# Altium schematic sheet R1250GS HandHeater and rear 5-12V.SchDoc: Rear power supply +5/12V; Clutch/Brake Heater
size A4; Revision: -; SheetNumber: 1; SheetTotal: 1; Version: 1.0; Variant: 4x Line of +5V and +12V; Modification: Clutch and Brake heater (ON by Drv Heater); Project: R1250GS HandHeater and rear 5-12V
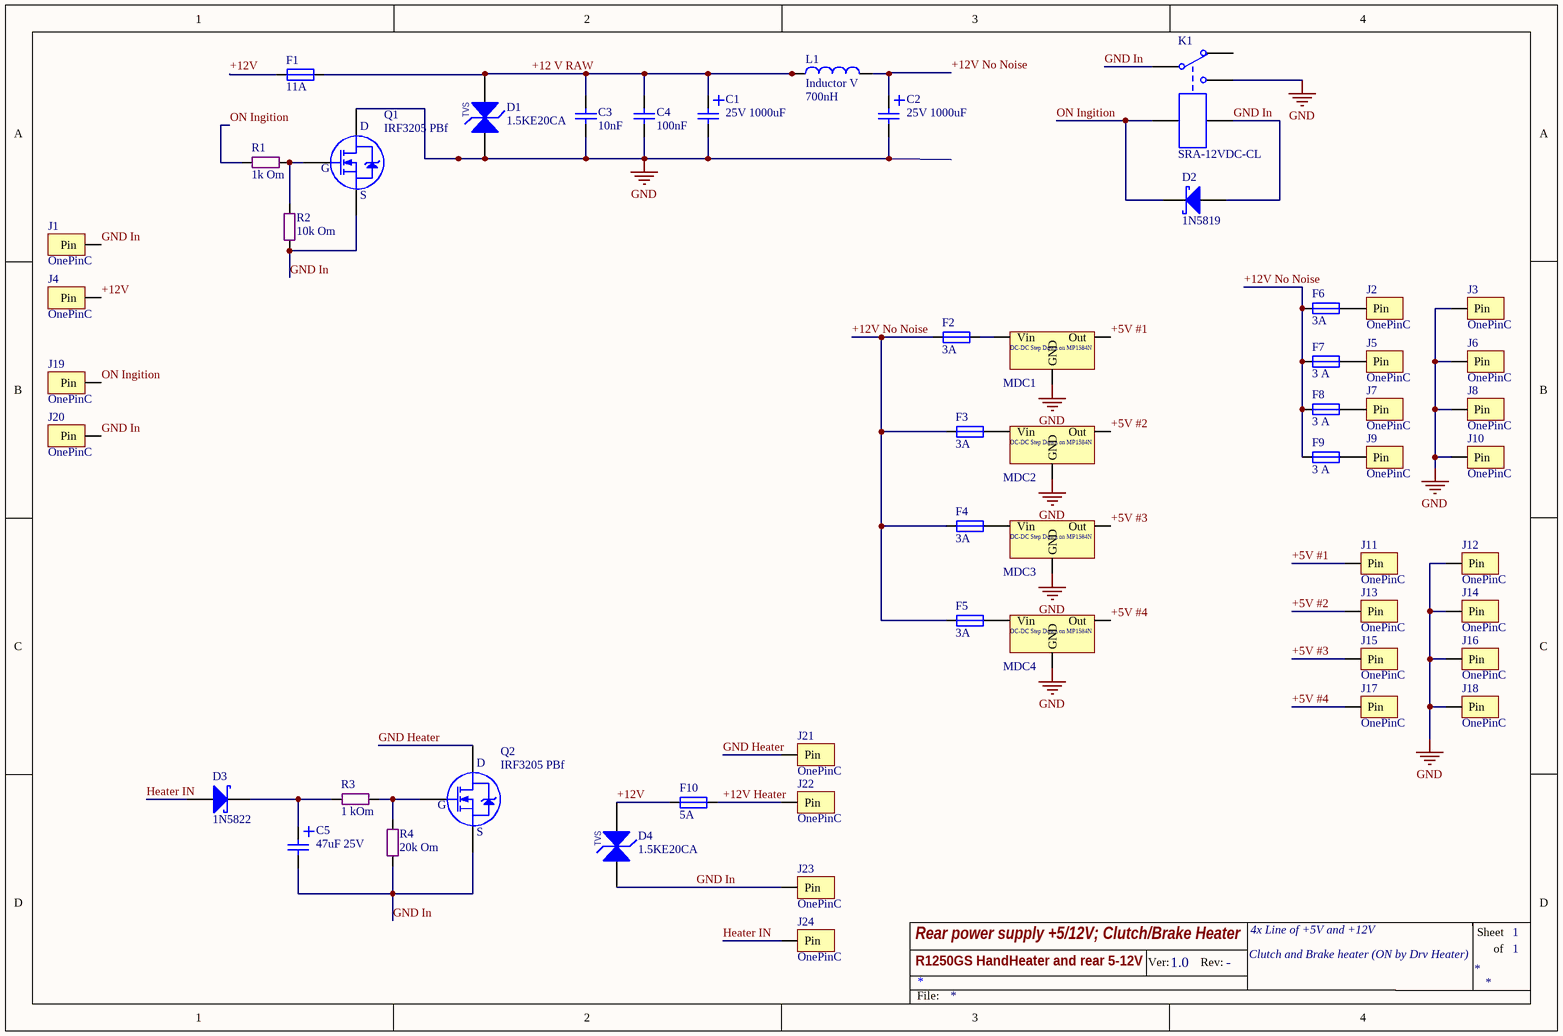
[diagram p0: R1250GS HandHeater and rear 5-12V.SchDoc]

## Parts
C1  25V 1000uF  [Cap E p5.08mm D10.2mm (3p)]
C2  25V 1000uF  [Cap E p5.08mm D10.2mm (3p)]
C3  10nF  [SMD 1206 (3216)]
C4  100nF  [SMD 1206 (3216)]
C5  47uF 25V  [Cap E p2mm D6.5xH11]
D1  1.5KE20CA  [TVS diode DO-201 V]
D2  1N5819  [Diode DO-35]
D3  1N5822  [Diode DO-41 - Vertical]
D4  1.5KE20CA  [TVS diode DO-201 V]
F1  11A  [Fuse RGE1100]
F2  3A  [Fuse SM250]
F3  3A  [Fuse SM250]
F4  3A  [Fuse SM250]
F5  3A  [Fuse SM250]
F6  3A  [Fuse MF-R300 (3A)]
F7  3 A  [Fuse MF-R300 (3A)]
F8  3 A  [Fuse MF-R300 (3A)]
F9  3 A  [Fuse MF-R300 (3A)]
F10  5A  [Fuse MF-R500 (5A)]
J1  OnePinC  [OnePin 1.8x4 - Square]
J2  OnePinC  [OnePin 1.2x3 - Rounded]
J3  OnePinC  [OnePin 1.2x3 - Square]
J4  OnePinC  [OnePin 1.8x4 - Rounded]
J5  OnePinC  [OnePin 1.2x3 - Rounded]
J6  OnePinC  [OnePin 1.2x3 - Square]
J7  OnePinC  [OnePin 1.2x3 - Rounded]
J8  OnePinC  [OnePin 1.2x3 - Square]
J9  OnePinC  [OnePin 1.2x3 - Rounded]
J10  OnePinC  [OnePin 1.2x3 - Square]
J11  OnePinC  [OnePin 1.2x3 - Rounded]
J12  OnePinC  [OnePin 1.2x3 - Square]
J13  OnePinC  [OnePin 1.2x3 - Rounded]
J14  OnePinC  [OnePin 1.2x3 - Square]
J15  OnePinC  [OnePin 1.2x3 - Rounded]
J16  OnePinC  [OnePin 1.2x3 - Square]
J17  OnePinC  [OnePin 1.2x3 - Rounded]
J18  OnePinC  [OnePin 1.2x3 - Square]
J19  OnePinC  [OnePin 1.2x3]
J20  OnePinC  [OnePin 1.2x3 - Square]
J21  OnePinC  [OnePin 1.8x4 - Square]
J22  OnePinC  [OnePin 1.8x4 - Rounded]
J23  OnePinC  [OnePin 1.2x3 - Square]
J24  OnePinC  [OnePin 1.2x3]
K1  SRA-12VDC-CL  [SRA-12VDC-CL]
L1  Inductor V  value 700nH  [Toroid V D20 W7]
MDC1  DC-DC  [DC-DC_MP1584N (SMALL)]  (value not drawn)
MDC2  DC-DC  [DC-DC_MP1584N (SMALL)]  (value not drawn)
MDC3  DC-DC  [DC-DC_MP1584N (SMALL)]  (value not drawn)
MDC4  DC-DC  [DC-DC_MP1584N (SMALL)]  (value not drawn)
Q1  IRF3205 PBf  [TO220-2 HighPower]
Q2  IRF3205 PBf  [TO220-2 HighPower]
R1  1k Om  [SMD 0805 (2012)]
R2  10k Om  [SMD 0805 (2012)]
R3  1 kOm  [SMD 0805 (2012)]
R4  20k Om  [SMD 0805 (2012)]

## Nets
GND: C1.2 C2.2 C3.2 C4.2 D1.1 J3.1(Pin) J6.1(Pin) J8.1(Pin) J10.1(Pin) J12.1(Pin) J14.1(Pin) J16.1(Pin) J18.1(Pin) K1.3 MDC1.GND MDC2.GND MDC3.GND MDC4.GND Q1.2(D)
+5V #1: J11.1(Pin) MDC1.OUT(Out)
+5V #2: J13.1(Pin) MDC2.OUT(Out)
+5V #3: J15.1(Pin) MDC3.OUT(Out)
+5V #4: J17.1(Pin) MDC4.OUT(Out)
+12 V RAW: C1.1 C3.1 C4.1 D1.2 F1.2 L1.1
+12V: D4.2 F1.1 F10.1 J4.1(Pin)
+12V Heater: F10.2 J22.1(Pin)
+12V No Noise: C2.1 F2.2 F3.2 F4.2 F5.2 F6.2 F7.2 F8.2 F9.2 L1.2
GND Heater: J21.1(Pin) Q2.2(D)
GND In: C5.2 D2.A D4.1 J1.1(Pin) J20.1(Pin) J23.1(Pin) K1.2 K1.5 Q1.3(S) Q2.3(S) R2.1 R4.1
Heater IN: D3.A J24.1(Pin)
ON Ingition: D2.K J19.1(Pin) K1.4 R1.1
NetC5_1: C5.1 D3.K R3.1
NetF2_1: F2.1 MDC1.IN(Vin)
NetF3_1: F3.1 MDC2.IN(Vin)
NetF4_1: F4.1 MDC3.IN(Vin)
NetF5_1: F5.1 MDC4.IN(Vin)
NetF6_1: F6.1 J2.1(Pin)
NetF7_1: F7.1 J5.1(Pin)
NetF8_1: F8.1 J7.1(Pin)
NetF9_1: F9.1 J9.1(Pin)
NetQ1_1: Q1.1(G) R1.2 R2.2
NetQ2_1: Q2.1(G) R3.2 R4.2

Not connected (* = marked no-connect by the designer): K1 1

## Notes on the sheet
- Ver:
- Rev:
- Sheet
- of
- File:
- (in symbol DC-DC MP1584N) DC-DC Step Down on MP1584N
- (in symbol TVS 1.5KE20CA) TVS

## Library data of the parts
C1 C2 = Cap E 1000mF x 25V: Capacitor
C3 C4 = Cap Ceramic SMD (All): Capacitor
C5 = Cap Elecrolitic: Capacitor
D1 D4 = TVS 1.5KE20CA: 1500W Transil (TVS Diode); Stand-Off V: 17.1; Load A: 5; Breakdown V: min 19 max 21; PackageReference: DO-201; Pulse Power: 1500W; VALUE: 1.5KE20CA
D2 = D Shotki All: Shotki  Diode; VALUE: 1N5822; PackageReference: DO-201
D3 = D Shotki All: Shotki  Diode; PackageReference: DO-201; VALUE: 1N5822
F1-F10 = Fuse: Round fuse
J1-J24 = OnePin Connector: Only pad
K1 = SRA-12VDC-CL: Single-Pole Dual-Throw Relay; R обм: 240 Om; I (DC = 30 V): 10A; I (AC = 240 V): 15-20A; U: 12 V; Name: SRA-12VDC-CL; DataSheet: http://tec.org.ru/_bd/12/1208_SRA.pdf
L1 = Inductor V: Inductor Vertical; Code_IEC: 1005; Published: 8-Jun-2000; LatestRevisionDate: 29-May-2009; LatestRevisionNote: IPC-7351 Footprint Added.; PackageReference: 0402-A; Publisher: Altium Limited; PackageDescription: Chip Inductor; Code_JEITA: 0402
MDC1-MDC4 = DC-DC MP1584N: DC-DC StepDown
Q1 Q2 = IRF3205: N-Channel 55V - 0.008Ω - 110A; Monufacturer: IOR; RDS Сопротивление Сток-Исток: 0.008 Om; I d - Drain current (continuous) at TC = 100°C: 80 A; VGS Порог Открытия: +2....+4 V; VGS Макс напр на гейте: +-20 V; C ISS Входная емкость: 3247 pF; C OSS Выходная емкость: 781 pF; V DSS (v): 55V; I d - Drain current (continuous) at TC = 25°C: 110 A; Name: IRF3205 PBf; Datasheet: http://tec.org.ru/_bd/2/223_IRF3205.pdf; URL: http://tec.org.ru/board/49-1-0-223
R1-R4 = Res All Types